# EAGLE design M2 (EAGLE 7.7.0)
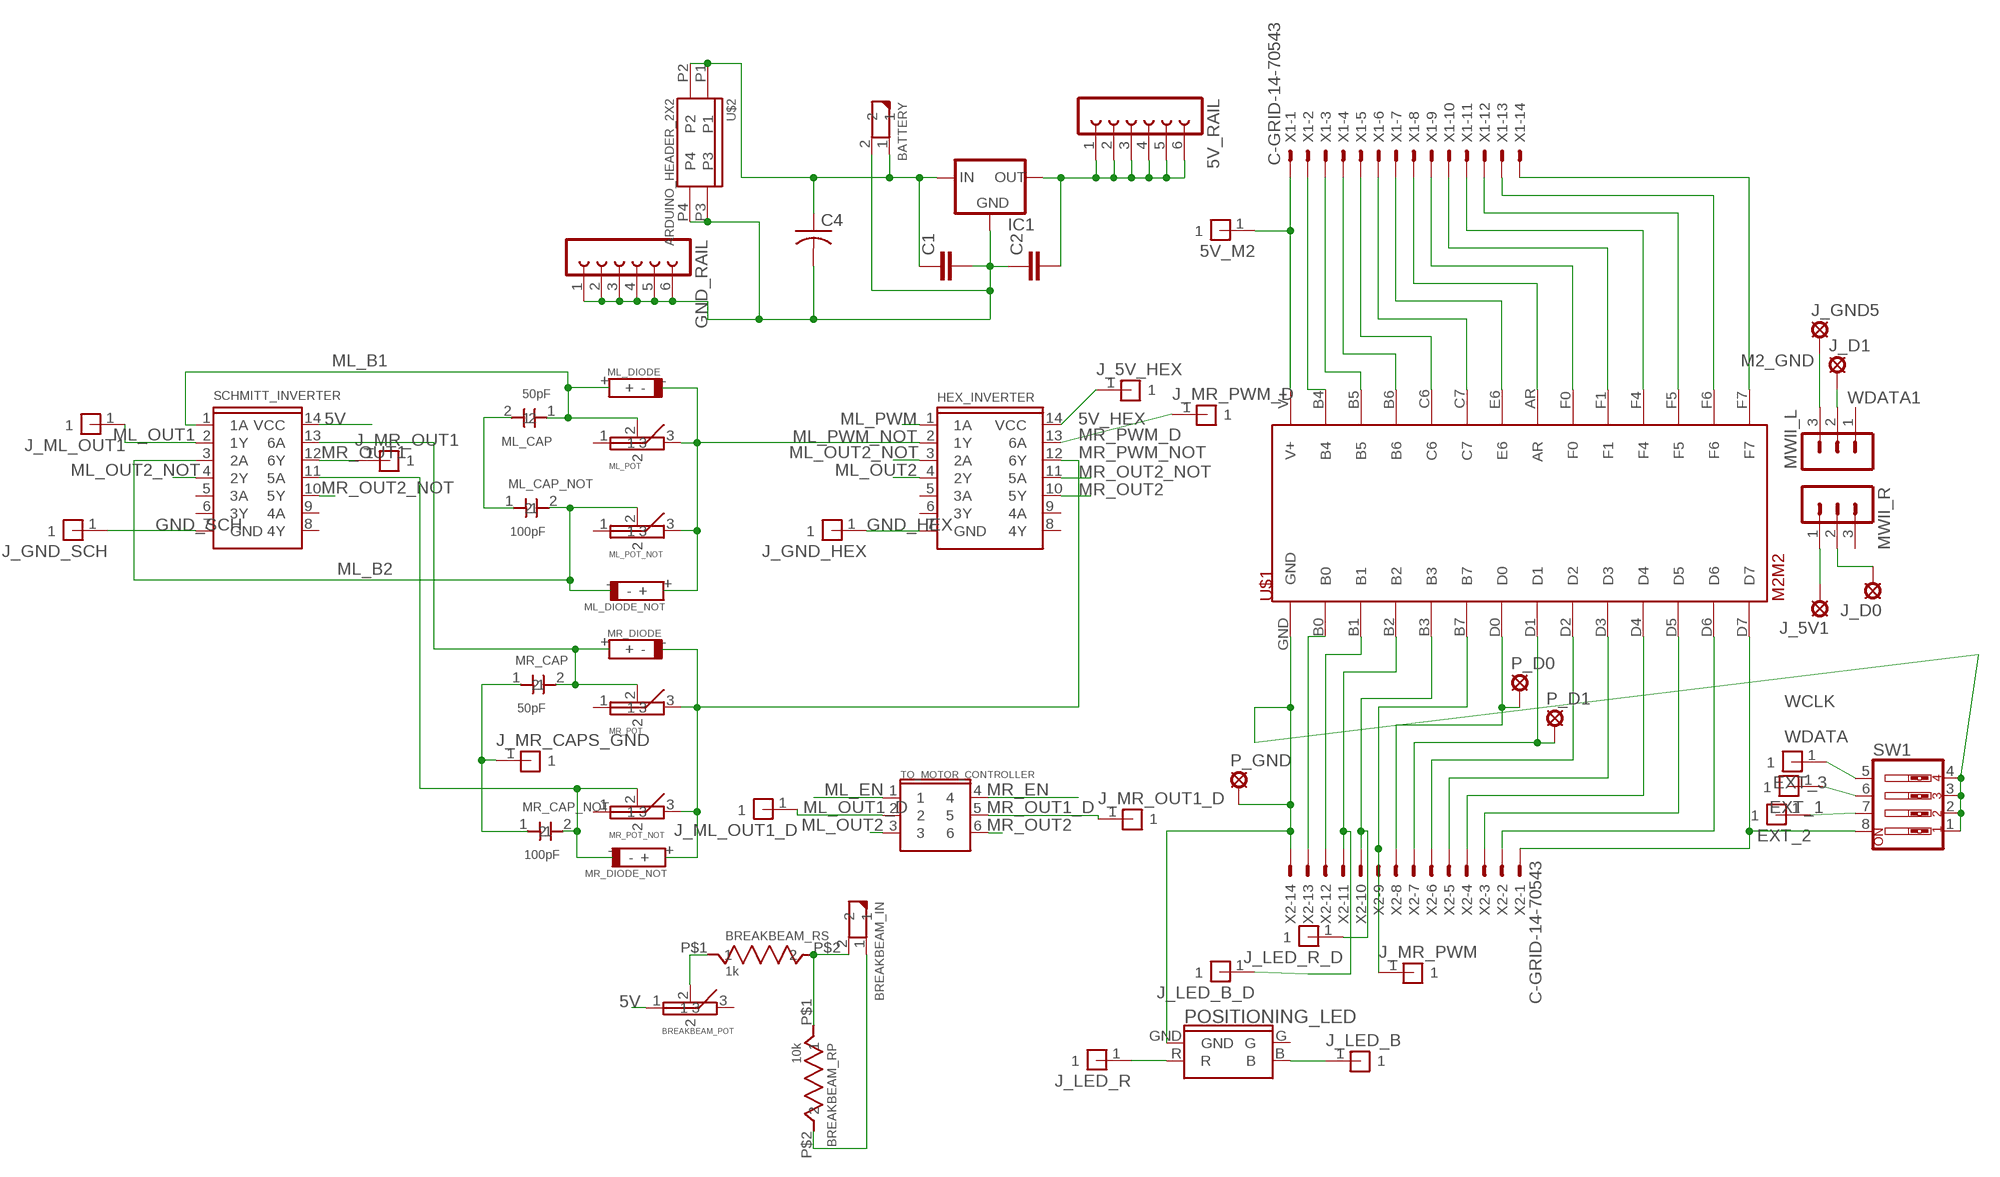
[diagram p0: schematic, sheet 1]

## Parts
5V_M2  ARDUINO_HEADER_1X1_OCTAGON  [ARDUINO_HEADER_1X1_OCTAGON]
5V_RAIL  FE06-1  [FE06]
BATTERY  MOLEX_2_PIN  [MOLEX_2_PIN]
BREAKBEAM_IN  MOLEX_2_PIN  [MOLEX_2_PIN]
BREAKBEAM_POT  POTENTIOMETER_1  [POTENTIOMETER_1]
BREAKBEAM_RP  10k  RESISTOR_THROUGH_8MM  [RESISTOR_THROUGH_8MM]
BREAKBEAM_RS  1k  RESISTOR_THROUGH_8MM  [RESISTOR_THROUGH_8MM]
C1  C2,5-3  [C2.5-3]
C2  C2,5-3  [C2.5-3]
C4  C-US050-025X075  [C050-025X075]
EXT_1  ARDUINO_HEADER_1X1_OCTAGON  [ARDUINO_HEADER_1X1_OCTAGON]
EXT_2  ARDUINO_HEADER_1X1_OCTAGON  [ARDUINO_HEADER_1X1_OCTAGON]
EXT_3  ARDUINO_HEADER_1X1_OCTAGON  [ARDUINO_HEADER_1X1_OCTAGON]
GND_RAIL  FE06-1  [FE06]
HEX_INVERTER  SN74HC04N_HEX_INVERTER  [DIP14]
IC1  78MXXS  [78MXXS]
J_5V1  LSP10  [LSP10]
J_5V_HEX  ARDUINO_HEADER_1X1_OCTAGON  [ARDUINO_HEADER_1X1_OCTAGON]
J_D0  LSP10  [LSP10]
J_D1  LSP10  [LSP10]
J_GND5  LSP10  [LSP10]
J_GND_HEX  ARDUINO_HEADER_1X1_OCTAGON  [ARDUINO_HEADER_1X1_OCTAGON]
J_GND_SCH  ARDUINO_HEADER_1X1_OCTAGON  [ARDUINO_HEADER_1X1_OCTAGON]
J_LED_B  ARDUINO_HEADER_1X1_OCTAGON  [ARDUINO_HEADER_1X1_OCTAGON]
J_LED_B_D  ARDUINO_HEADER_1X1_OCTAGON  [ARDUINO_HEADER_1X1_OCTAGON]
J_LED_R  ARDUINO_HEADER_1X1_OCTAGON  [ARDUINO_HEADER_1X1_OCTAGON]
J_LED_R_D  ARDUINO_HEADER_1X1_OCTAGON  [ARDUINO_HEADER_1X1_OCTAGON]
J_ML_OUT1  ARDUINO_HEADER_1X1_OCTAGON  [ARDUINO_HEADER_1X1_OCTAGON]
J_ML_OUT1_D  ARDUINO_HEADER_1X1_OCTAGON  [ARDUINO_HEADER_1X1_OCTAGON]
J_MR_CAPS_GND  ARDUINO_HEADER_1X1_OCTAGON  [ARDUINO_HEADER_1X1_OCTAGON]
J_MR_OUT1  ARDUINO_HEADER_1X1_OCTAGON  [ARDUINO_HEADER_1X1_OCTAGON]
J_MR_OUT1_D  ARDUINO_HEADER_1X1_OCTAGON  [ARDUINO_HEADER_1X1_OCTAGON]
J_MR_PWM  ARDUINO_HEADER_1X1_OCTAGON  [ARDUINO_HEADER_1X1_OCTAGON]
J_MR_PWM_D  ARDUINO_HEADER_1X1_OCTAGON  [ARDUINO_HEADER_1X1_OCTAGON]
ML_CAP  50pF  CERAMIC_CAPACITOR  [CERAMIC_CAPACITOR]
ML_CAP_NOT  100pF  CERAMIC_CAPACITOR  [CERAMIC_CAPACITOR]
ML_DIODE  1N914B  [1N914B]
ML_DIODE_NOT  1N914B  [1N914B]
ML_POT  POTENTIOMETER_1  [POTENTIOMETER_1]
ML_POT_NOT  POTENTIOMETER_1  [POTENTIOMETER_1]
MR_CAP  50pF  CERAMIC_CAPACITOR  [CERAMIC_CAPACITOR]
MR_CAP_NOT  100pF  CERAMIC_CAPACITOR  [CERAMIC_CAPACITOR]
MR_DIODE  1N914B  [1N914B]
MR_DIODE_NOT  1N914B  [1N914B]
MR_POT  POTENTIOMETER_1  [POTENTIOMETER_1]
MR_POT_NOT  POTENTIOMETER_1  [POTENTIOMETER_1]
MWII_L  MA03-1  [MA03-1]
MWII_R  MA03-1  [MA03-1]
P_D0  LSP10  [LSP10]
P_D1  LSP10  [LSP10]
P_GND  LSP10  [LSP10]
POSITIONING_LED  RGB_LED  [RBG_LED]
SCHMITT_INVERTER  SN74HC14N_SCHMITT_INVERTER  [DIP14]
SW1  SW_DIP-4  [EDG-04]
TO_MOTOR_CONTROLLER  ARDUINO_HEADER_3X2  [ARDUINO_HEADER_3X2]
U$1  M2M2  [M2]
U$2  ARDUINO_HEADER_2X2  [ARDUINO_HEADER_2X2]
X1  C-GRID-14-70543  [70543-14]
X2  C-GRID-14-70543  [70543-14]

## Nets
5V: 5V_RAIL.1 5V_RAIL.2 5V_RAIL.3 5V_RAIL.4 5V_RAIL.5 5V_RAIL.6 BREAKBEAM_POT.1 C2.2 IC1.OUT SCHMITT_INVERTER.14(VCC)
5V_1: J_5V1.MP MWII_R.1
5V_HEX: HEX_INVERTER.14(VCC) J_5V_HEX.1
B2 [POWER]: J_LED_B_D.1 U$1.B2 X2.11
B3 [POWER]: J_LED_R_D.1 U$1.B3 X2.10
B5: U$1.B5 X1.3
BREAKBEAM_OUT: BREAKBEAM_IN.2 BREAKBEAM_RP.P$1 BREAKBEAM_RS.P$2 U$1.C6 X1.5
C7: U$1.C7 X1.6
GND: ML_CAP.2 ML_CAP_NOT.1
GND_HEX: HEX_INVERTER.7(GND) J_GND_HEX.1
GND_SCH: J_GND_SCH.1 SCHMITT_INVERTER.7(GND)
IN_GND: BATTERY.2 C1.2 C2.1 C4.2 GND_RAIL.1 GND_RAIL.2 GND_RAIL.3 GND_RAIL.4 GND_RAIL.5 GND_RAIL.6 IC1.GND U$2.P3 U$2.P4
LED_B: J_LED_B.1 POSITIONING_LED.B
LED_R: J_LED_R.1 POSITIONING_LED.R
M2_GND: BREAKBEAM_IN.1 BREAKBEAM_RP.P$2 J_GND5.MP MWII_L.3
ML_B1: ML_CAP.1 ML_DIODE.+ ML_POT.2 SCHMITT_INVERTER.1(1A)
ML_B2: ML_CAP_NOT.2 ML_DIODE_NOT.- ML_POT_NOT.2 SCHMITT_INVERTER.3(2A)
ML_EN [POWER]: TO_MOTOR_CONTROLLER.1 U$1.B0 X2.13
ML_OUT1: J_ML_OUT1.1 SCHMITT_INVERTER.2(1Y)
ML_OUT1_D: J_ML_OUT1_D.1 TO_MOTOR_CONTROLLER.2
ML_OUT2: HEX_INVERTER.4(2Y) TO_MOTOR_CONTROLLER.3
ML_OUT2_NOT: HEX_INVERTER.3(2A) SCHMITT_INVERTER.4(2Y)
ML_PWM: HEX_INVERTER.1(1A) U$1.B6 X1.4
ML_PWM_NOT: HEX_INVERTER.2(1Y) ML_DIODE.- ML_DIODE_NOT.+ ML_POT.3 ML_POT_NOT.3
MR_CAPS_GND: J_MR_CAPS_GND.1 MR_CAP.1 MR_CAP_NOT.1
MR_EN [POWER]: TO_MOTOR_CONTROLLER.4 U$1.B1 X2.12
MR_OUT1: J_MR_OUT1.1 SCHMITT_INVERTER.12(6Y)
MR_OUT1_D: J_MR_OUT1_D.1 TO_MOTOR_CONTROLLER.5
MR_OUT2: HEX_INVERTER.10(5Y) TO_MOTOR_CONTROLLER.6
MR_OUT2_NOT: HEX_INVERTER.11(5A) SCHMITT_INVERTER.10(5Y)
MR_PWM: J_MR_PWM.1 U$1.B7 X2.9
MR_PWM_D: HEX_INVERTER.13(6A) J_MR_PWM_D.1
MR_PWM_NOT: HEX_INVERTER.12(6Y) MR_DIODE.- MR_DIODE_NOT.+ MR_POT.3 MR_POT_NOT.3
N$1: MR_CAP.2 MR_DIODE.+ MR_POT.2 SCHMITT_INVERTER.13(6A)
N$2: U$1.B4 X1.2
N$3: P_GND.MP POSITIONING_LED.GND SW1.1 SW1.2 SW1.3 SW1.4 U$1.GND X2.14
N$4: MR_CAP_NOT.2 MR_DIODE_NOT.- MR_POT_NOT.2 SCHMITT_INVERTER.11(5A)
N$5: EXT_2.1 SW1.7
N$6: BREAKBEAM_POT.2 BREAKBEAM_RS.P$1
N$7: U$1.E6 X1.7
N$8: U$1.AR X1.8
N$9: U$1.F0 X1.9
N$10: U$1.F1 X1.10
N$11: U$1.F4 X1.11
N$12: U$1.F5 X1.12
N$13: U$1.F6 X1.13
N$14: EXT_1.1 SW1.6
N$15: U$1.F7 X1.14
N$16: EXT_3.1 SW1.5
N$19: 5V_M2.1 U$1.V+ X1.1
N$24: U$1.D2 X2.6
N$25: U$1.D3 X2.5
N$26: U$1.D4 X2.4
N$27: U$1.D5 X2.3
N$28: U$1.D6 X2.2
N$29: SW1.8 U$1.D7 X2.1
VIN [POWER]: BATTERY.1 C1.1 C4.1 IC1.IN U$2.P1 U$2.P2
WCLK: P_D0.MP U$1.D0 X2.8
WCLK_1: J_D0.MP MWII_R.2
WDATA: P_D1.MP U$1.D1 X2.7
WDATA1: J_D1.MP MWII_L.2
Unconnected: BREAKBEAM_POT.3 HEX_INVERTER.5(3A) HEX_INVERTER.6(3Y) HEX_INVERTER.8(4Y) HEX_INVERTER.9(4A) ML_POT.1 ML_POT_NOT.1 MR_POT.1 MR_POT_NOT.1 MWII_L.1 MWII_R.3 POSITIONING_LED.G SCHMITT_INVERTER.5(3A) SCHMITT_INVERTER.6(3Y) SCHMITT_INVERTER.8(4Y) SCHMITT_INVERTER.9(4A)

## Library data of the parts
5V_M2 EXT_1-EXT_3 J_5V_HEX J_GND_HEX J_GND_SCH J_LED_B J_LED_B_D J_LED_R J_LED_R_D J_ML_OUT1 J_ML_OUT1_D J_MR_CAPS_GND J_MR_OUT1 J_MR_OUT1_D J_MR_PWM J_MR_PWM_D = ben_kramer:ARDUINO_HEADER_1X1_OCTAGON
5V_RAIL GND_RAIL = con-lsta:FE06-1: FEMALE HEADER; OC_FARNELL: unknown; OC_NEWARK: unknown
BATTERY BREAKBEAM_IN = ben_kramer:MOLEX_2_PIN
BREAKBEAM_POT ML_POT ML_POT_NOT MR_POT MR_POT_NOT = ben_kramer:POTENTIOMETER_1
BREAKBEAM_RP BREAKBEAM_RS = ben_kramer:RESISTOR_THROUGH_8MM
C1 C2 = capacitor-wima:C: CAPACITOR naming: grid - package width
C4 = rcl:C-US: CAPACITOR, American symbol
HEX_INVERTER = ben_kramer:SN74HC04N_HEX_INVERTER
IC1 = v-reg:78MXXS: VOLTAGE REGULATOR
J_5V1 J_D0 J_D1 J_GND5 P_D0 P_D1 P_GND = solpad:LSP10: SOLDER PAD drill 1.0 mm, distributor Buerklin, 12H555
ML_CAP ML_CAP_NOT MR_CAP MR_CAP_NOT = ben_kramer:CERAMIC_CAPACITOR
ML_DIODE ML_DIODE_NOT MR_DIODE MR_DIODE_NOT = ben_kramer:1N914B
MWII_L MWII_R = con-lstb:MA03-1: PIN HEADER; OC_FARNELL: unknown; OC_NEWARK: unknown
POSITIONING_LED = ben_kramer:RGB_LED
SCHMITT_INVERTER = ben_kramer:SN74HC14N_SCHMITT_INVERTER
SW1 = special:SW_DIP-4: DIP SWITCH
TO_MOTOR_CONTROLLER = ben_kramer:ARDUINO_HEADER_3X2
U$1 = m2:M2
U$2 = ben_kramer:ARDUINO_HEADER_2X2
X1 X2 = con-molex:C-GRID-14: CONNECTOR wire to board 2.54 mm (0.100") pitch header; OC_FARNELL: unknown; OC_NEWARK: unknown

## Net classes
0 default: width 0.406 mm, clearance 0.254 mm
1 POWER: width 0.61 mm, clearance 0.254 mm

## Board
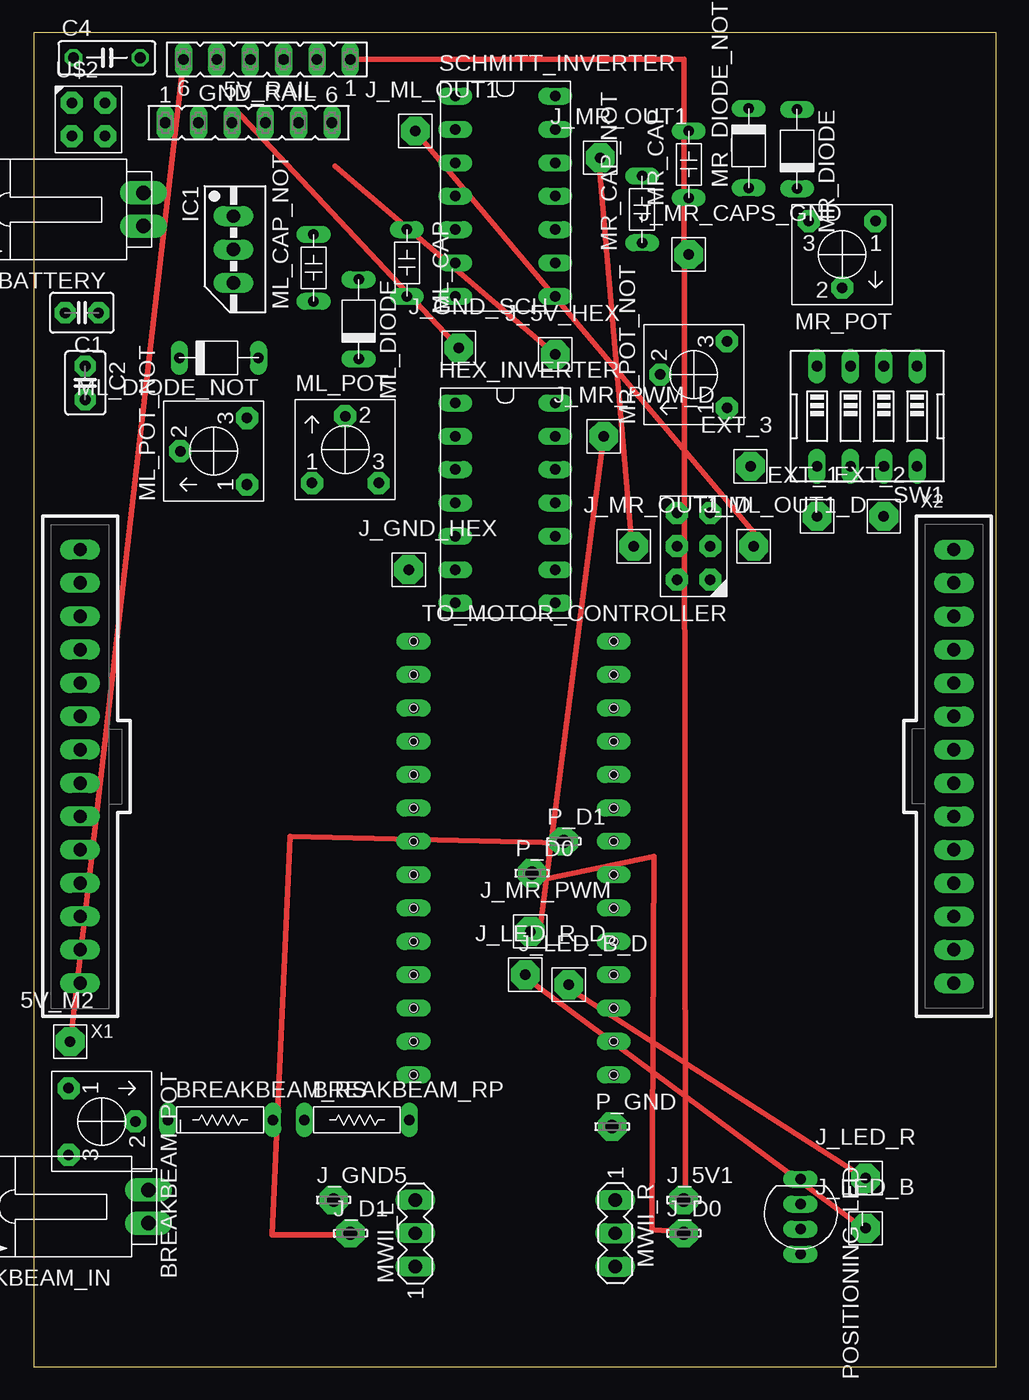
[diagram p1: board, top side]
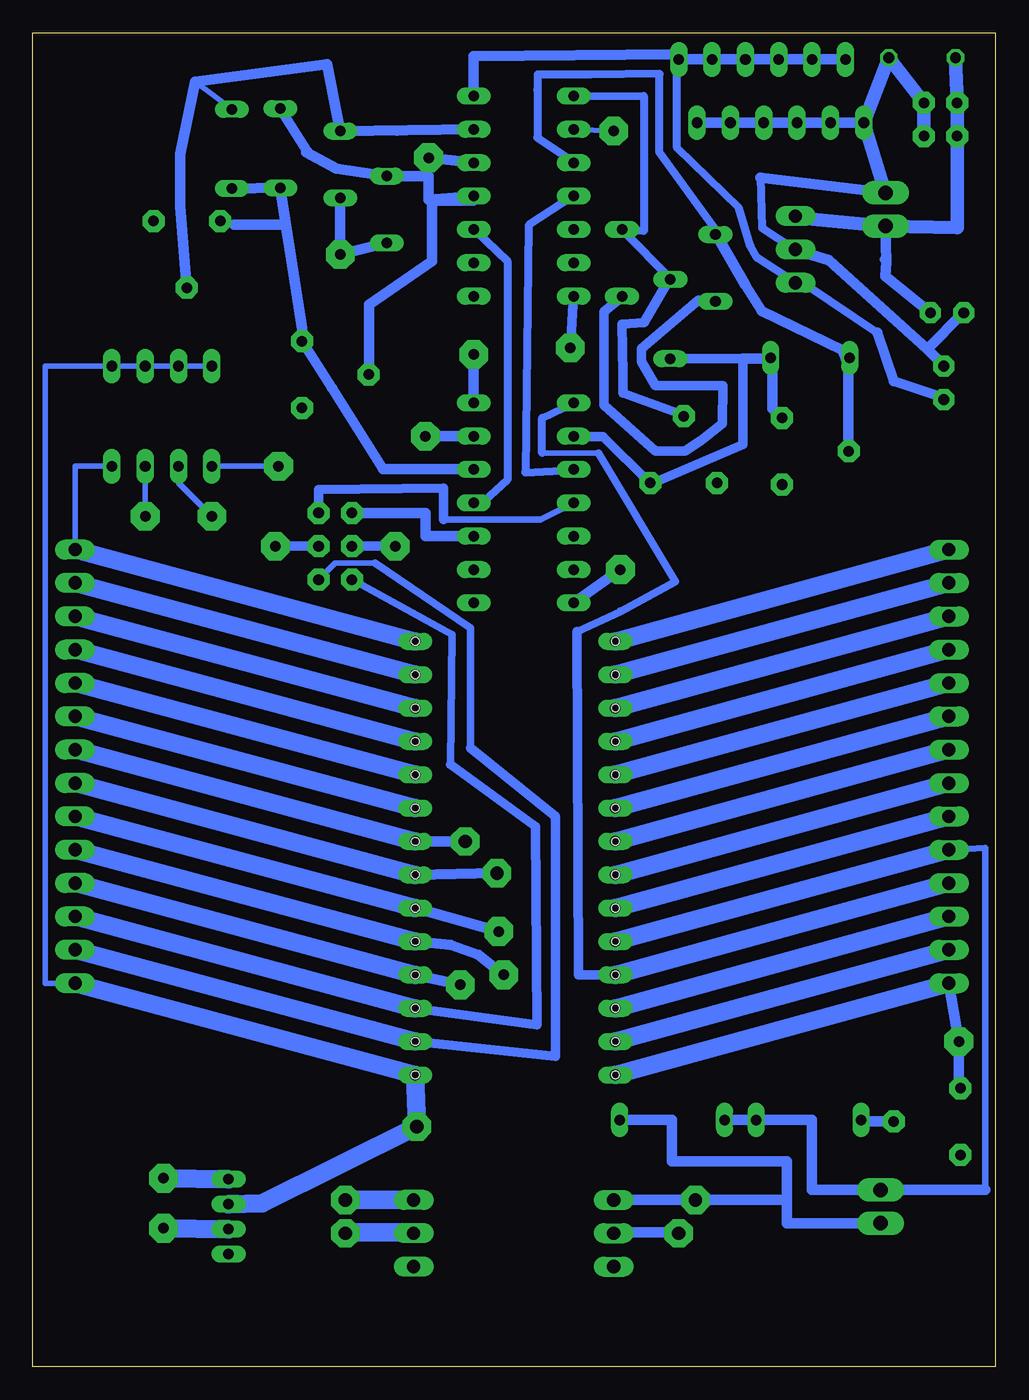
[diagram p2: board, bottom side, seen from below]

Size 73.33 x 101.59 mm. Coordinates in mm from the lower left corner, seen from the top.
Outline: 0,0 73.33,0 73.33,101.59 0,101.59 0,0
Copper layers (1*16): Top 0.035mm / dielectric 1.5mm / Bottom 0.035mm
Design rules "default": minimum track width 10mil, minimum drill 24mil, track to track 8mil, track to pad 8mil, pad to pad 8mil, via to via 8mil, smd to smd 8mil, copper to edge 40mil, drill to drill 8mil, minimum pad ring 10mil, minimum via ring 8mil, stop-mask expansion 4mil, vias tented up to drill 0mil, thermal gap 10mil

### Footprints (pad centres in the part's own frame; a part is rotated, then mirrored left to right if it is on the bottom)
ARDUINO_HEADER_1X1_OCTAGON = drill 0.8 pad 2.184 octagon: 1 0,0
FE06 = drill 0.813 long: 1 -6.35,0; 2 -3.81,0; 3 -1.27,0; 4 1.27,0; 5 3.81,0; 6 6.35,0
MOLEX_2_PIN = drill 1.1 pad 1.778 long: 1 -1.27,-6.35; 2 1.27,-6.35
POTENTIOMETER_1 = drill 0.8 pad 1.676 octagon: 1 -2.54,0; 2 0,5.08; 3 2.54,0
RESISTOR_THROUGH_8MM = drill 0.8 long: P$1 -4,0; P$2 4,0
C2.5-3 = drill 0.813 pad 1.6 octagon: 1 -1.27,0; 2 1.27,0
C050-025X075 = drill 0.813 octagon: 1 -2.54,0; 2 2.54,0
DIP14 = drill 0.8 long: 1 -3.81,7.62; 2 -3.81,5.08; 3 -3.81,2.54; 4 -3.81,0; 5 -3.81,-2.54; 6 -3.81,-5.08; 7 -3.81,-7.62; 8 3.81,-7.62; 9 3.81,-5.08; 10 3.81,-2.54; 11 3.81,0; 12 3.81,2.54; 13 3.81,5.08; 14 3.81,7.62
78MXXS = drill 1.016 long: GND 0,-2.54; IN -2.54,-2.54; OUT 2.54,-2.54
LSP10 = drill 1.016 pad 2.159 octagon: MP 0,0
CERAMIC_CAPACITOR = drill 0.8 long: 1 -2.54,0; 2 2.54,0
1N914B = drill 0.8 long: + -3.175,0; - 2.857,0
MA03-1 = drill 1.016 long: 1 -2.54,0; 2 0,0; 3 2.54,0
RBG_LED = drill 0.8 pad 1.27 long: B 0.953,0; G 2.857,0; GND -0.953,0; R -2.857,0
EDG-04 = drill 0.813 long: 1 -3.81,-3.81; 2 -1.27,-3.81; 3 1.27,-3.81; 4 3.81,-3.81; 5 3.81,3.81; 6 1.27,3.81; 7 -1.27,3.81; 8 -3.81,3.81
ARDUINO_HEADER_3X2 = drill 0.8 pad 1.676 octagon: 1 -1.27,2.54; 2 -1.27,0; 3 -1.27,-2.54; 4 1.27,2.54; 5 1.27,0; 6 1.27,-2.54
M2 = drill 0.8 long: AR 1.27,7.62; B0 -13.97,-7.62; B1 -11.43,-7.62; B2 -8.89,-7.62; B3 -6.35,-7.62; B4 -13.97,7.62; B5 -11.43,7.62; B6 -8.89,7.62; B7 -3.81,-7.62; C6 -6.35,7.62; C7 -3.81,7.62; D0 -1.27,-7.62; D1 1.27,-7.62; D2 3.81,-7.62; D3 6.35,-7.62; D4 8.89,-7.62; D5 11.43,-7.62; D6 13.97,-7.62; D7 16.51,-7.62; E6 -1.27,7.62; F0 3.81,7.62; F1 6.35,7.62; F4 8.89,7.62; F5 11.43,7.62; F6 13.97,7.62; F7 16.51,7.62; GND -16.51,-7.62; V+ -16.51,7.62 | hole 0.6: -13.97,7.62; -8.89,7.62; -6.35,7.62; 6.35,7.62; 8.89,7.62; 11.43,7.62; 13.97,7.62; 16.51,7.62; 16.51,-7.62; 13.97,-7.62; 11.43,-7.62; 8.89,-7.62; 6.35,-7.62; 3.81,-7.62; 1.27,-7.62; -1.27,-7.62; -3.81,-7.62; -6.35,-7.62; -8.89,-7.62; -11.43,-7.62; -13.97,-7.62; -16.51,-7.62; -16.51,7.62; -11.43,7.62; -3.81,7.62; -1.27,7.62; 1.27,7.62; 3.81,7.62
ARDUINO_HEADER_2X2 = drill 0.8 pad 1.676 octagon: P1 -1.27,1.27; P2 -1.27,-1.27; P3 1.27,1.27; P4 1.27,-1.27
70543-14 = drill 1.016 long: 1 -16.51,0; 2 -13.97,0; 3 -11.43,0; 4 -8.89,0; 5 -6.35,0; 6 -3.81,0; 7 -1.27,0; 8 1.27,0; 9 3.81,0; 10 6.35,0; 11 8.89,0; 12 11.43,0; 13 13.97,0; 14 16.51,0

### Placement (x,y rotation side)
5V_M2  2.79,24.77 0 top
5V_RAIL  17.78,99.57 180 top
BATTERY  2.03,88.14 90 top
BREAKBEAM_IN  2.41,12.19 90 top
BREAKBEAM_POT  2.67,18.67 270 top
BREAKBEAM_RP  24.64,18.8 0 top
BREAKBEAM_RS  14.22,18.8 0 top
C1  3.68,80.26 180 top
C2  3.94,74.93 270 top
C4  5.59,99.69 0 top
EXT_1  59.69,64.77 0 top
EXT_2  64.77,64.77 0 top
EXT_3  54.61,68.58 0 top
GND_RAIL  16.38,94.74 0 top
HEX_INVERTER  35.94,65.79 0 top
IC1  17.78,85.09 270 top
J_5V1  49.53,12.7 0 top
J_5V_HEX  39.75,77.09 0 top
J_D0  49.53,10.16 0 top
J_D1  24.13,10.16 0 top
J_GND5  22.86,12.7 0 top
J_GND_HEX  28.57,60.71 0 top
J_GND_SCH  32.38,77.6 0 top
J_LED_B  63.37,10.54 0 top
J_LED_B_D  40.77,29.08 0 top
J_LED_R  63.37,14.35 0 top
J_LED_R_D  37.47,29.84 0 top
J_ML_OUT1  29.08,94.11 0 top
J_ML_OUT1_D  54.86,62.48 0 top
J_MR_CAPS_GND  49.91,84.71 0 top
J_MR_OUT1  43.18,92.08 0 top
J_MR_OUT1_D  45.72,62.48 0 top
J_MR_PWM  37.85,33.15 0 top
J_MR_PWM_D  43.43,70.87 0 top
ML_CAP  28.45,84.07 270 top
ML_CAP_NOT  21.34,83.69 90 top
ML_DIODE  24.77,79.63 270 top
ML_DIODE_NOT  13.97,76.83 180 top
ML_POT  23.75,67.31 0 top
ML_POT_NOT  16.26,69.72 90 top
MR_CAP  49.91,91.57 90 top
MR_CAP_NOT  46.35,88.14 90 top
MR_DIODE  58.17,92.58 270 top
MR_DIODE_NOT  54.48,92.96 90 top
MR_POT  61.59,87.25 180 top
MR_POT_NOT  52.83,75.56 90 top
MWII_L  29.08,10.16 90 top
MWII_R  44.32,10.16 270 top
P_D0  37.97,37.59 0 top
P_D1  40.39,40.01 0 top
P_GND  44.07,18.29 0 top
POSITIONING_LED  58.42,11.43 270 top
SCHMITT_INVERTER  35.94,89.15 0 top
SW1  63.5,72.39 180 top
TO_MOTOR_CONTROLLER  50.29,62.48 180 top
U$1  36.58,38.73 90 top
U$2  4.19,95 0 top
X1  3.56,45.72 90 top
X2  70.1,45.72 270 top

### Tracks (layer width: path | path; a pad name or v marks a point on that pad's centre or on a via)
5V  (1 unrouted)
  Top 0.406: 2.79,24.64 5V_RAIL.6
  Bottom 0.406: 3.96,73.8 C2.2 | 15.19,82.39 IC1.OUT | 24.26,99.94 5V_RAIL.1 | BREAKBEAM_POT.1 2.79,21.21
  Bottom 0.559: 19.56,88.27 24.26,92.84
  Bottom 0.61: 9.02,78.74 14.36,82.39 15.19,82.39 | IC1.OUT 18.16,84.45 18.67,85.34 19.56,88.27 | 24.26,92.84 24.26,99.94
  Bottom 0.813: 9.02,78.74 7.75,75.07 3.96,73.8 | 5V_RAIL.6 5V_RAIL.5 5V_RAIL.4 5V_RAIL.3 5V_RAIL.2 5V_RAIL.1 | SCHMITT_INVERTER.14 39.75,99.82 24.26,99.94 | 2.79,21.21 2.79,24.64
5V_1
  Bottom 0.406: 44.41,12.71 MWII_R.1 | 49.53,12.71 J_5V1.MP
  Bottom 1.422: 49.53,12.71 44.41,12.71
5V_HEX
  Bottom 0.813: HEX_INVERTER.14 J_5V_HEX.1
B2
  Bottom 0.813: U$1.B2 J_LED_B_D.1
  Bottom 1.422: X2.11 U$1.B2
B3
  Bottom 0.813: U$1.B3 41.53,32.13 39.37,31.37 J_LED_R_D.1
  Bottom 1.422: X2.10 U$1.B3
B5
  Bottom 1.422: X1.3 U$1.B5
BREAKBEAM_OUT
  Bottom 0.406: BREAKBEAM_RS.P$2 BREAKBEAM_RP.P$1
  Bottom 0.508: X1.5 0.76,39.5 0.76,13.46
  Bottom 0.813: BREAKBEAM_RP.P$1 13.97,18.8 13.97,13.46 BREAKBEAM_IN.2 0.76,13.46
  Bottom 1.422: X1.5 U$1.C6
C7
  Bottom 1.422: X1.6 U$1.C7
GND
  Bottom 0.406: 28.56,81.39 ML_CAP.2
  Bottom 0.711: ML_CAP_NOT.1 21.13,81.23 22.62,81.23 26.96,77.52 26.96,76.53 25.92,74.73 20.78,74.73 20.8,71.83 22.45,70.55 23.66,69.72 25.92,69.72 29.81,73.23 29.83,80.34 28.56,81.39
GND_HEX
  Bottom 0.813: J_GND_HEX.1 HEX_INVERTER.7
GND_SCH
  Bottom 0.711: SCHMITT_INVERTER.7 J_GND_SCH.1
IN_GND
  Bottom 0.406: 15.19,85.03 IC1.GND | 3.96,76.28 C2.1 | 2.48,80.24 C1.2
  Bottom 0.61: 17.91,90.55 17.78,86.74 IC1.GND
  Bottom 0.813: 15.19,85.03 12.71,84.26 5.2,77.51 | 3.96,76.28 5.2,77.51 | 5.2,77.51 2.48,80.24 | GND_RAIL.1 GND_RAIL.2 GND_RAIL.3 GND_RAIL.4 GND_RAIL.5 GND_RAIL.6 | BATTERY.2 17.91,90.55
  Bottom 1.016: BATTERY.2 GND_RAIL.1 C4.2 U$2.P3 U$2.P4
LED_B
  Bottom 1.422: J_LED_B.1 POSITIONING_LED.B
LED_R
  Top 0.406: J_LED_R.1 41.15,28.57
  Bottom 1.422: POSITIONING_LED.R J_LED_R.1
M2_GND
  Bottom 0.406: 29.06,12.71 MWII_L.3 | 22.95,12.71 J_GND5.MP
  Bottom 0.813: 22.95,12.71 29.06,12.71 | BREAKBEAM_RP.P$2 24.64,18.8 24.64,15.62 15.88,15.62 15.88,12.7 | 15.88,12.7 J_GND5.MP | BREAKBEAM_IN.1 15.88,10.92 15.88,12.7
ML_B1
  Bottom 0.406: 24.77,82.88 ML_DIODE.+ 24.93,82.72 | 28.4,86.51 ML_CAP.1 28.56,86.68 | 32.03,96.8 32.03,96.75 SCHMITT_INVERTER.1
  Bottom 0.61: 28.4,86.51 24.77,82.88 | 32.03,96.8 26.8,96.77 26.8,86.49 ML_CAP.1
  Bottom 0.711: 24.93,82.72 26.8,79.5 28.45,79.39 28.38,75.58 28.38,74.17 23.77,72.48 ML_POT.2
ML_B2
  Bottom 0.406: 11.23,76.77 ML_DIODE_NOT.- 11.39,76.77 | 11.23,69.84 ML_POT_NOT.2 | 20.97,86.35 ML_CAP_NOT.2 21.13,86.35 | 32.19,91.8 SCHMITT_INVERTER.3
  Bottom 0.61: 32.19,91.8 34.9,93.61 34.9,97.24 34.87,98.41 30.87,98.41 25.59,98.46 25.59,92.46 21.13,86.35
  Bottom 0.813: 11.23,69.84 11.23,76.77 | 20.97,86.35 20.97,85.69 19.05,82.39 17.78,80.39 11.67,77.41 11.39,76.77
ML_EN
  Bottom 0.406: TO_MOTOR_CONTROLLER.1 50.29,61.21 47.24,61.21
  Bottom 0.559: 40.01,47.12 40.01,56.26 47.24,61.21
  Bottom 0.711: U$1.B0 33.53,23.62 33.53,41.91 40.01,47.12
  Bottom 1.422: X2.13 U$1.B0
ML_OUT1
  Top 0.406: J_ML_OUT1.1 55.63,62.61
  Bottom 0.406: J_ML_OUT1.1 SCHMITT_INVERTER.2
ML_OUT1_D
  Bottom 0.711: TO_MOTOR_CONTROLLER.2 J_ML_OUT1_D.1
ML_OUT2
  Bottom 0.508: HEX_INVERTER.4 34.67,64.52 42.04,64.52
  Bottom 0.711: 42.04,64.52 42.04,66.93 51.56,66.8 TO_MOTOR_CONTROLLER.3
ML_OUT2_NOT
  Bottom 0.406: 32.32,68.3 32.19,68.35 HEX_INVERTER.3 | 32.19,89.15 SCHMITT_INVERTER.4
  Bottom 0.61: 32.32,68.3 35.81,68.11 35.56,86.93 32.19,89.15
ML_PWM
  Bottom 0.406: 30.23,69.6 34.54,69.6
  Bottom 0.559: 24.38,59.82 30.23,69.6
  Bottom 0.61: 31.88,56.01 28.57,57.53 24.38,59.82 | 34.54,69.6 34.54,72.26 HEX_INVERTER.1
  Bottom 0.711: U$1.B6 31.75,29.84 31.88,56.01
  Bottom 1.422: U$1.B6 X1.4
ML_PWM_NOT
  Bottom 0.406: 32.03,70.83 HEX_INVERTER.2 | 26.42,67.36 ML_POT.3 26.25,67.36 25.92,67.36 | 16.34,72.31 17,72.97 | 17.34,76.77 ML_DIODE_NOT.+
  Bottom 0.711: 32.03,70.83 29.88,70.83 26.42,67.36 | ML_DIODE.- 19.25,76.77 19.25,70.22 25.92,67.36
  Bottom 0.813: 17,72.97 17,76.77 ML_DIODE_NOT.+ | 16.34,72.31 ML_POT_NOT.3 | 17.34,76.77 19.25,76.77
MR_CAPS_GND
  Bottom 0.813: MR_CAP.1 J_MR_CAPS_GND.1 MR_CAP_NOT.1
MR_EN
  Bottom 0.559: 41.53,45.85 41.4,55.75 TO_MOTOR_CONTROLLER.4
  Bottom 0.711: U$1.B1 34.92,26.04 35.05,41.15 41.53,45.85
  Bottom 1.422: U$1.B1 X2.12
MR_OUT1
  Bottom 0.813: J_MR_OUT1.1 SCHMITT_INVERTER.12
MR_OUT1_D
  Bottom 0.711: TO_MOTOR_CONTROLLER.5 J_MR_OUT1_D.1
MR_OUT2
  Bottom 0.813: HEX_INVERTER.10 43.43,63.25 43.43,65.02 TO_MOTOR_CONTROLLER.6
MR_OUT2_NOT
  Bottom 0.406: 38.96,65.88 39.62,65.88 HEX_INVERTER.11 | 39.62,86.51 SCHMITT_INVERTER.10
  Bottom 0.61: 38.96,65.88 37.19,67.53 37.19,84.2 39.62,86.51
MR_PWM
  Bottom 0.813: U$1.B7 J_MR_PWM.1
  Bottom 1.422: X2.9 U$1.B7
MR_PWM_D
  Bottom 0.813: HEX_INVERTER.13 J_MR_PWM_D.1
MR_PWM_NOT
  Bottom 0.406: 39.79,68.35 HEX_INVERTER.12 | 57.99,86.98 MR_POT.3 | 54.27,86.98 MR_POT_NOT.3
  Bottom 0.813: 39.79,68.35 46.65,68.35 50.55,74.54 MR_POT_NOT.3 52.83,79.07 MR_DIODE_NOT.+ MR_DIODE.- | 54.27,86.98 57.99,86.98
N$1
  Bottom 0.406: 39.66,94.23 SCHMITT_INVERTER.13 | 45.57,93.94 MR_CAP.2 | 60.98,97.85 MR_DIODE.+
  Bottom 0.813: 39.66,94.23 MR_CAP.2 50.93,99.19 60.98,97.85 62.1,92.33 62.1,88.39 MR_POT.2
N$2
  Bottom 1.422: X1.2 U$1.B4
N$3
  Bottom 0.406: SW1.4 SW1.3 SW1.2 SW1.1 72.39,76.2 72.39,29.21 X2.14
  Bottom 1.422: X2.14 U$1.GND P_GND.MP 55.88,12.45 POSITIONING_LED.GND
N$4
  Bottom 0.406: 39.79,88.82 39.79,89.15 SCHMITT_INVERTER.11 | 47.71,75.62 MR_POT_NOT.2
  Bottom 0.61: 52.43,92.58 52.5,92.51
  Bottom 0.813: 52.5,92.51 50.19,91.24 MR_CAP_NOT.2 43.18,90.68 43.18,88.9 SCHMITT_INVERTER.11 | 52.43,92.58 MR_DIODE_NOT.- | 39.79,88.82 42.93,88.82 42.93,84.2 47.71,80.9 47.71,75.62
N$5
  Bottom 0.406: SW1.7 EXT_2.1
N$6
  Bottom 0.406: 10.22,18.67 BREAKBEAM_RS.P$1
  Bottom 0.813: BREAKBEAM_POT.2 10.22,18.67
N$7
  Bottom 1.422: U$1.E6 X1.7
N$8
  Bottom 1.422: X1.8 U$1.AR
N$9
  Bottom 1.422: U$1.F0 X1.9
N$10
  Bottom 1.422: X1.10 U$1.F1
N$11
  Bottom 1.422: U$1.F4 X1.11
N$12
  Bottom 1.422: X1.12 U$1.F5
N$13
  Bottom 1.422: U$1.F6 X1.13
N$14
  Bottom 0.406: SW1.6 62.23,67.31 EXT_1.1
N$15
  Bottom 1.422: X1.14 U$1.F7
N$16
  Bottom 0.406: SW1.5 EXT_3.1
N$18
  Top 0.406: 40.39,39.88 19.56,40.39 18.16,10.03 24.13,10.03
N$19
  Bottom 0.813: X1.1 5V_M2.1
  Bottom 1.422: X1.1 U$1.V+
N$20
  Top 0.406: 39.75,77.09 22.99,91.44
N$22
  Top 0.406: 32.51,77.47 15.24,95.89
N$23
  Top 0.406: 43.43,70.74 38.61,33.66
N$24
  Bottom 1.422: X2.6 U$1.D2
N$25
  Bottom 1.422: U$1.D3 X2.5
N$26
  Bottom 1.422: X2.4 U$1.D4
N$27
  Bottom 1.422: U$1.D5 X2.3
N$28
  Bottom 1.422: X2.2 U$1.D6
N$29
  Bottom 0.406: X2.1 70.1,68.58 SW1.8
  Bottom 1.422: U$1.D7 X2.1
N$30
  Top 0.406: 45.59,62.48 43.05,92.2
N$31
  Top 0.406: 49.66,12.7 49.53,99.57 24.26,99.57
N$32
  Top 0.406: 49.53,10.29 47.24,10.41
N$33
  Top 0.406: 47.12,10.41 47.24,38.86 38.1,36.96
N$35
  Top 0.406: 63.37,10.41 37.21,29.84
VIN
  Bottom 0.61: 8.32,84.13 8.52,84.33 | 15.19,87.5 IC1.IN
  Bottom 0.813: C1.1 8.38,83.05 8.32,84.13 BATTERY.1
  Bottom 1.016: C4.1 U$2.P1 U$2.P2 2.92,86.74 BATTERY.1 15.19,87.5
WCLK
  Bottom 0.813: P_D0.MP U$1.D0
  Bottom 1.422: U$1.D0 X2.8
WCLK_1
  Bottom 0.406: 44.41,10.24 MWII_R.2 | 49.53,10.24 J_D0.MP
  Bottom 1.422: 49.53,10.24 44.41,10.24
WDATA
  Bottom 0.406: 70.33,46.89 X2.7 | 40.45,40.12 P_D1.MP
  Bottom 0.813: U$1.D1 P_D1.MP
  Bottom 1.422: U$1.D1 X2.7
WDATA1
  Bottom 0.406: 29.06,10.24 MWII_L.2 | 24.27,10.24 J_D1.MP
  Bottom 0.813: 24.27,10.24 29.06,10.24

### Text on the board
tDocu: JUMPS SHOWN IN TOP LAYER / / D0 - MWii Right 2 / D1 - mWii Left 2 / 5V- mwii right 1 / GND - mwii right 3 / M2_5V - 5V / HEX_5V - 5V / HEX_GND - GND / SCHMITT_GND - GND / MR_CAPS GND - GND / MR_PWM - HEX_INV pin 13 / SCHMITT_ML_OUT1 - MOTOR CONTROLLER OUT / SCHMITT_MR_OUT1 - MOTOR CONTROLLER OUT / M2_B2 - LED_BLUE / M2_B3 - LED_RED